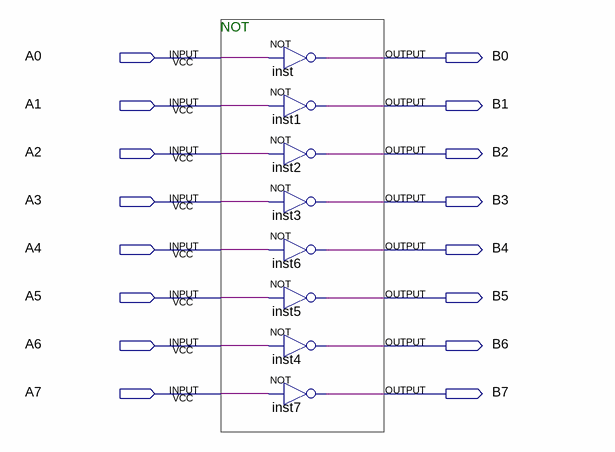
[diagram p0: schematic sheet]
// Quartus schematic 8bitnot.bdf as structural Verilog: 8 symbols, 16 pins
module \8bitnot  (
  input  A0,
  input  A1,
  input  A2,
  input  A3,
  input  A4,
  input  A5,
  input  A6,
  input  A7,
  output B0,
  output B1,
  output B2,
  output B3,
  output B4,
  output B5,
  output B6,
  output B7
);

  not inst (B0, A0);
  not inst1 (B1, A1);
  not inst2 (B2, A2);
  not inst3 (B3, A3);
  not inst6 (B4, A4);
  not inst5 (B5, A5);
  not inst4 (B6, A6);
  not inst7 (B7, A7);

  // Notes on the sheet:
  //   NOT 
endmodule
